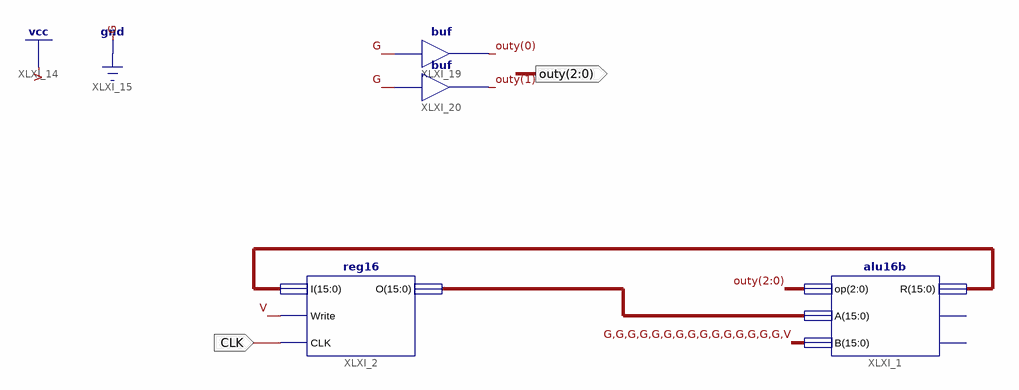
[diagram p0: schematic sheet 1]
// Xilinx ISE schematic PC_plus_ALU.sch (spartan3e) as structural Verilog: 4 symbols, 2 ports
module PC_plus_ALU (
  input  CLK,
  output [2:0] outy
);

  wire [15:0] XLXN_1, XLXN_3;

  alu16b XLXI_1 (.op(outy), .A(XLXN_1), .B(16'b0000000000000001), .R(XLXN_3));  // open: ovfl, zero
  reg16 XLXI_2 (.I(XLXN_3), .Write(1'b1), .CLK(CLK), .O(XLXN_1));
  buf XLXI_19 (outy[0], 1'b0);
  buf XLXI_20 (outy[1], 1'b0);
endmodule
